# EasyEDA schematic led_project.json
TITLE: LED Board; REV: 1.0; Date: 2022-07-28; Sheet: 1/1; Company: Symbiosis Institute of Technology
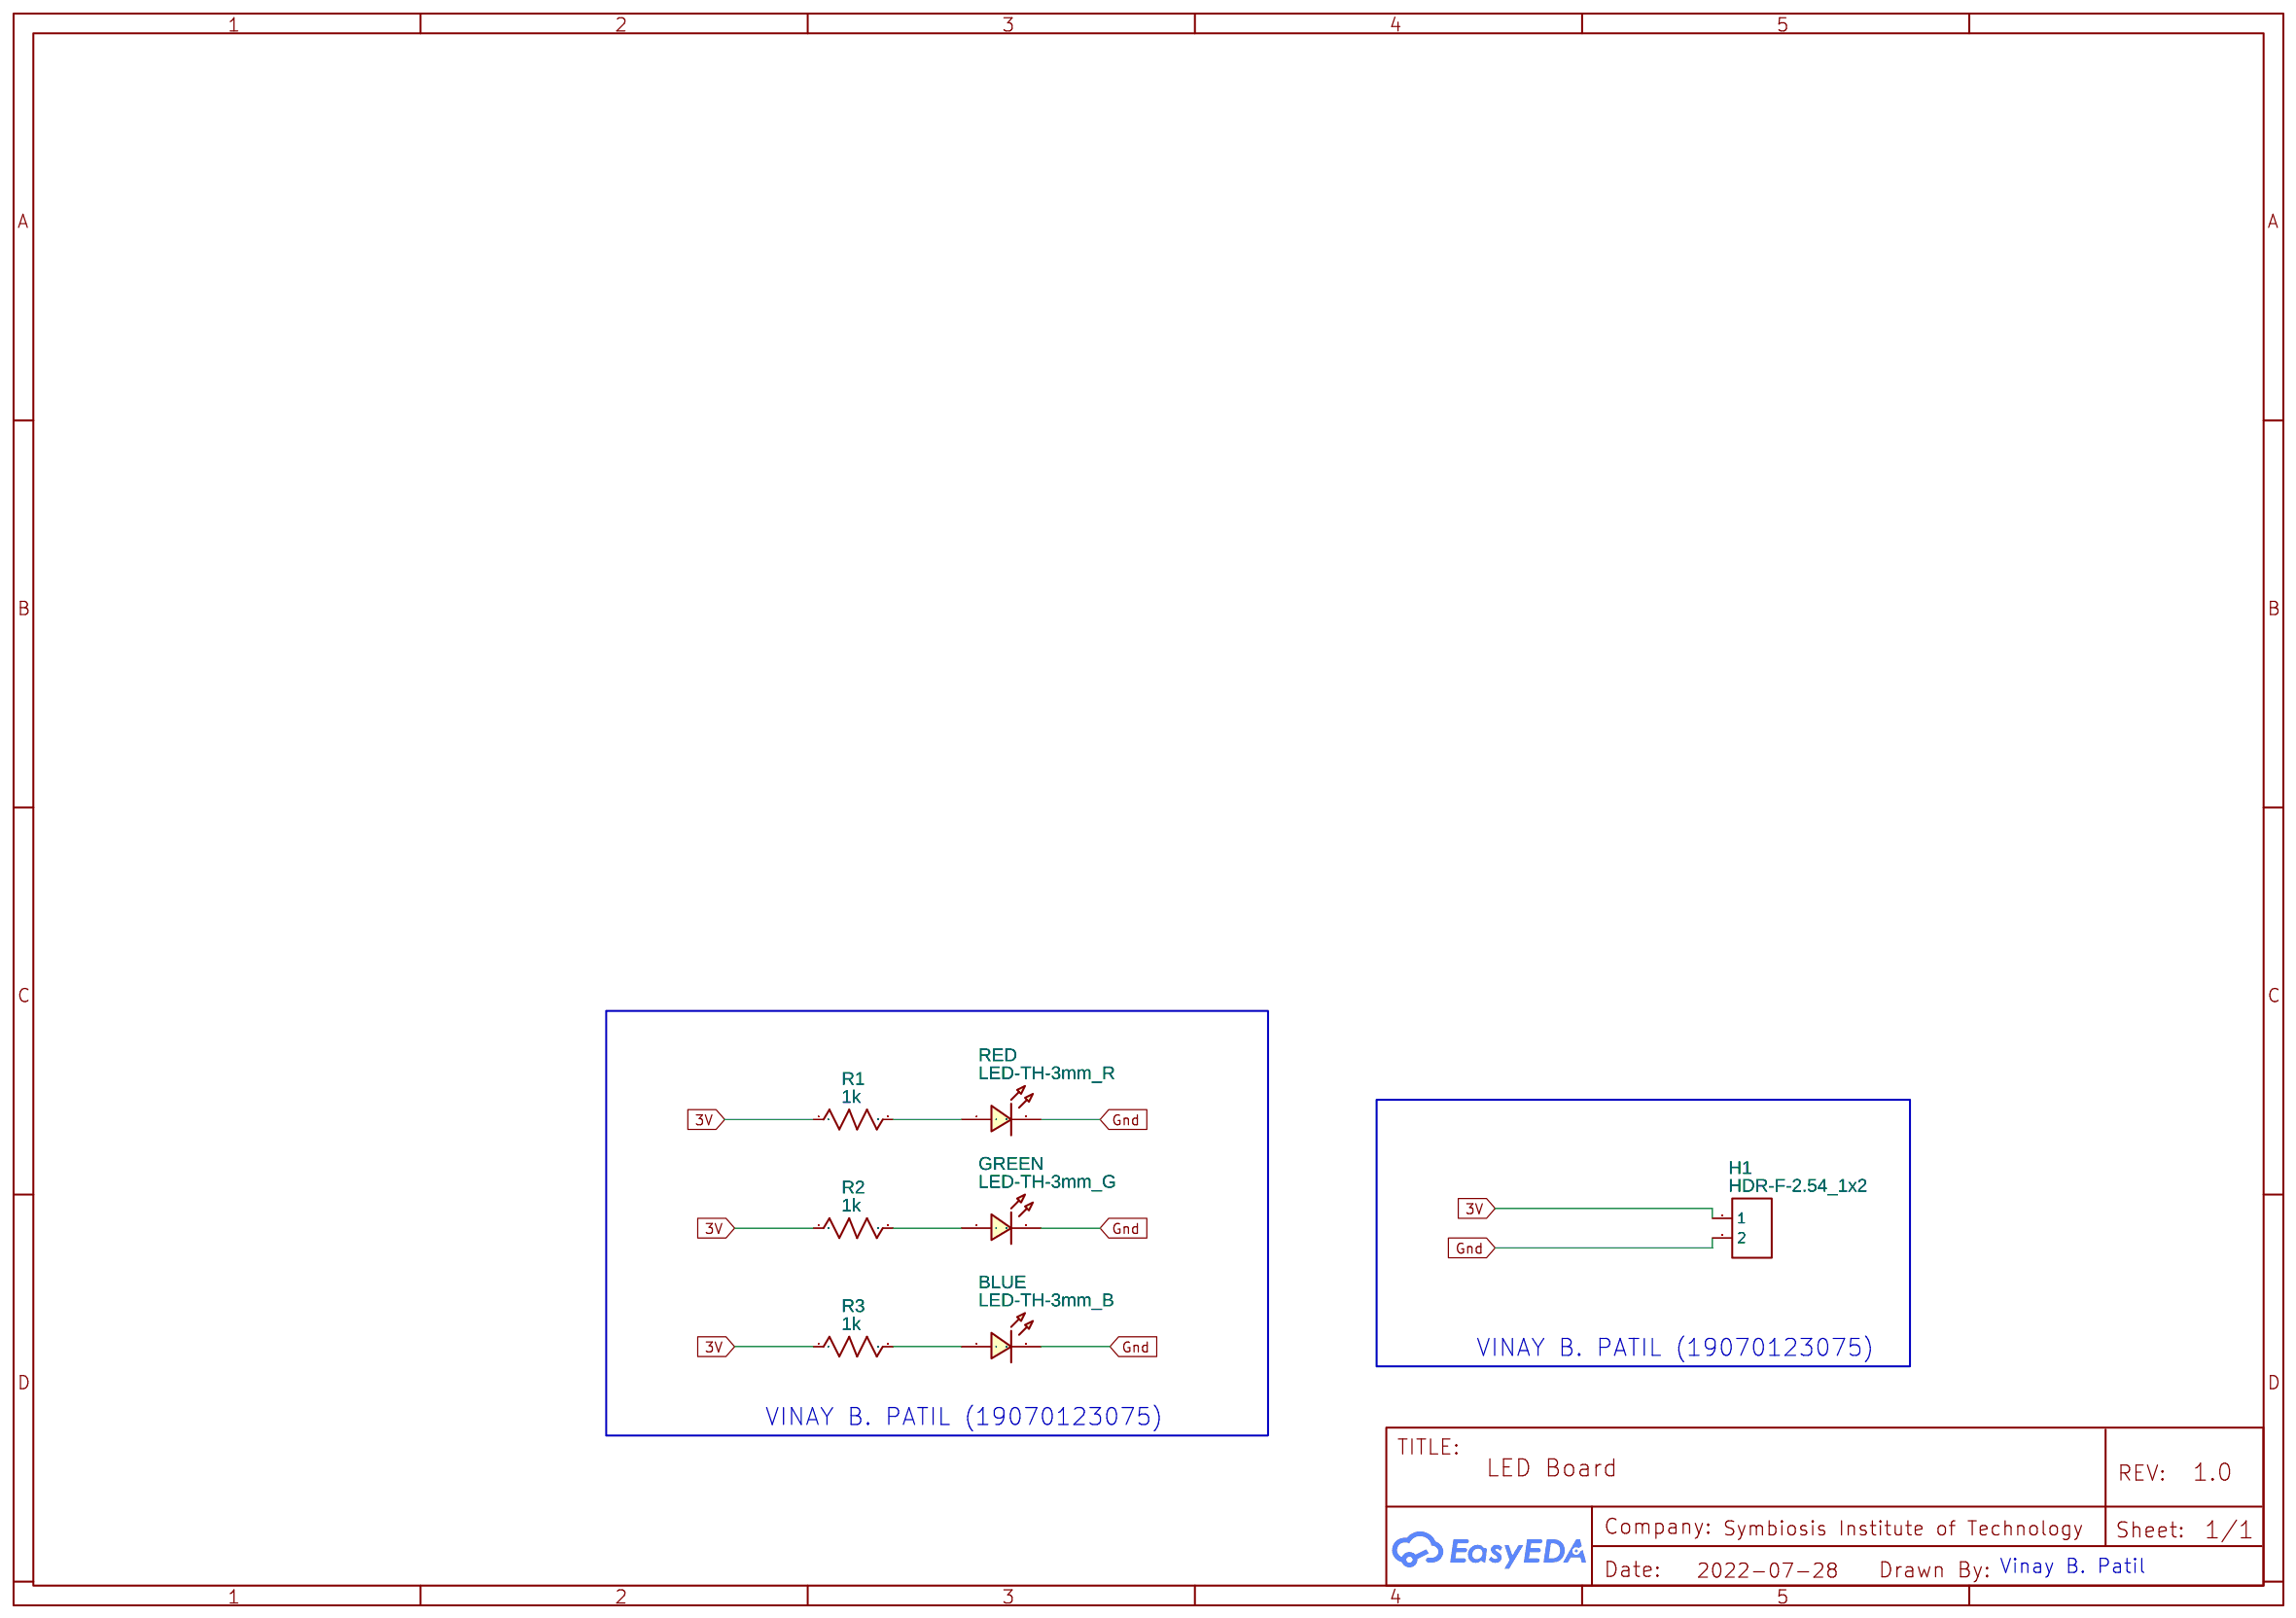
[diagram p0: schematic sheet]

## Parts
BLUE  LED-TH-3mm_B  [LED-TH_BD3.0_BLUE]
GREEN  LED-TH-3mm_G  [LED-TH_BD3.0_GREEN]
H1  HDR-F-2.54_1x2  [HDR-F-2.54_1X2]
R1  1k  [R_AXIAL-0.3]
R2  1k  [R_AXIAL-0.3]
R3  1k  [R_AXIAL-0.3]
RED  LED-TH-3mm_R  [LED-TH_BD3.0_RED]

## Library data of the parts
BLUE = LED-TH-3mm_B: Manufacturer: EVERLIGHT(台湾亿光); Manufacturer Part: 204-10SUBC/S400-A4; Supplier Part: C86881; Supplier: LCSC; Contributor: LCEDA_Lib
GREEN = LED-TH-3mm_G: Manufacturer: EVERLIGHT(台湾亿光); Manufacturer Part: 204-10SYGD/S530-E3; Supplier Part: C85161; Contributor: LCEDA_Lib
H1 = HDR-F-2.54_1x2: Supplier Part: C49661; Supplier: LCSC; Contributor: LCEDA_Lib
R1-R3 = R_AXIAL-0.3_US: Contributor: LCEDA_Lib
RED = LED-TH-3mm_R: Manufacturer: EVERLIGHT(台湾亿光); Manufacturer Part: 204-10SDRD/S530-A3-L; Supplier Part: C84774; Supplier: LCSC; Contributor: LCEDA_Lib

## Nets
3V: H1.1 R1.1 R2.1 R3.1
Gnd: BLUE.2 GREEN.2 H1.2 RED.2
Net-(BLUE-1): BLUE.1 R3.2
Net-(GREEN-1): GREEN.1 R2.2
Net-(R1-2): R1.2 RED.1

## Notes on the sheet
- VINAY B. PATIL (19070123075)
- VINAY B. PATIL (19070123075)
- Vinay B. Patil
